# EAGLE design 6566_adapter_2 (EAGLE 6.4)
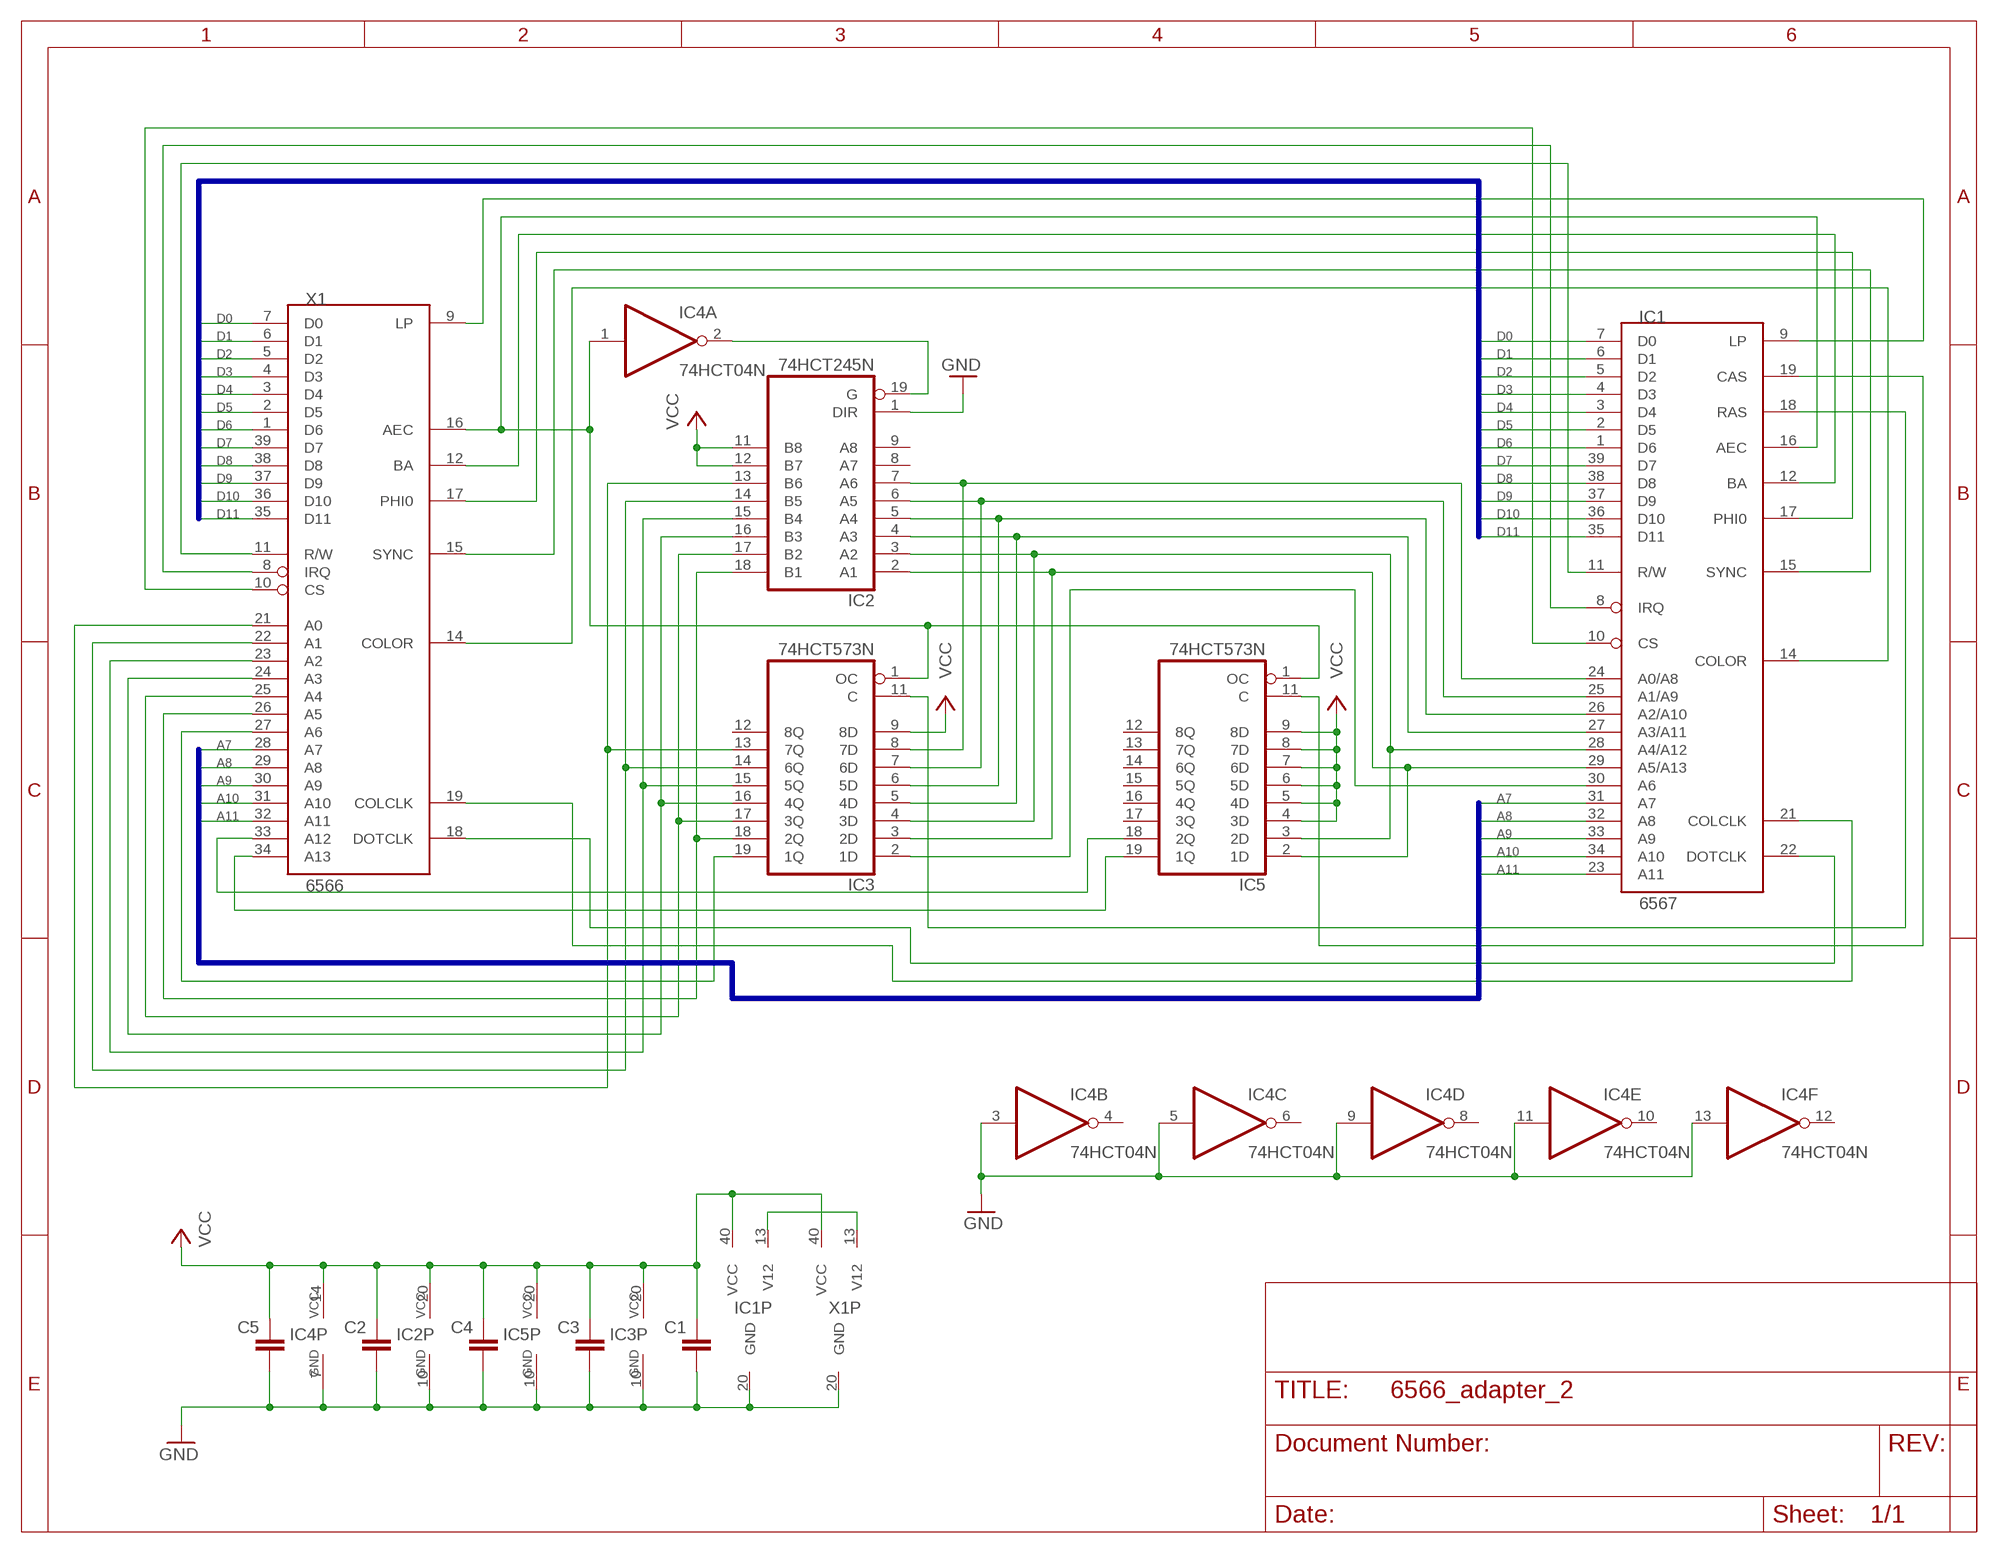
[diagram p0: schematic, sheet 1]

## Parts
C1  C-EU025-025X050  [C025-025X050]
C2  C-EU025-025X050  [C025-025X050]
C3  C-EU025-025X050  [C025-025X050]
C4  C-EU025-025X050  [C025-025X050]
C5  C-EU025-025X050  [C025-025X050]
IC1  6567  6569  [DIP40]
IC2  74HCT245N  [DIL20]
IC3  74HCT573N  [DIL20]
IC4  74HCT04N  [DIL14]
IC5  74HCT573N  [DIL20]
X1  6566  [DIL40]

## Nets
!AEC: IC2.19(G) IC4.2(A:O)
!CS: IC1.10(CS) X1.10(CS)
!IRQ: IC1.8(IRQ) X1.8(IRQ)
A0: IC2.13(B6) IC3.13(7Q) X1.21(A0)
A0_6567: IC1.24(A0/A8) IC2.7(A6) IC3.8(7D)
A1: IC2.14(B5) IC3.14(6Q) X1.22(A1)
A1_6567: IC1.25(A1/A9) IC2.6(A5) IC3.7(6D)
A2: IC2.15(B4) IC3.15(5Q) X1.23(A2)
A2_6567: IC1.26(A2/A10) IC2.5(A4) IC3.6(5D)
A3: IC2.16(B3) IC3.16(4Q) X1.24(A3)
A3_6567: IC1.27(A3/A11) IC2.4(A3) IC3.5(4D)
A4: IC2.17(B2) IC3.17(3Q) X1.25(A4)
A4_6567: IC1.28(A4/A12) IC2.3(A2) IC3.4(3D) IC5.3(2D)
A5: IC2.18(B1) IC3.18(2Q) X1.26(A5)
A5_6567: IC1.29(A5/A13) IC2.2(A1) IC3.3(2D) IC5.2(1D)
A6: IC3.19(1Q) X1.27(A6)
A6_6567: IC1.30(A6) IC3.2(1D)
A7: IC1.31(A7) X1.28(A7)
A8: IC1.32(A8) X1.29(A8)
A9: IC1.33(A9) X1.30(A9)
A10: IC1.34(A10) X1.31(A10)
A11: IC1.23(A11) X1.32(A11)
A12: IC5.18(2Q) X1.33(A12)
A13: IC5.19(1Q) X1.34(A13)
AEC: IC1.16(AEC) IC3.1(OC) IC4.1(A:I) IC5.1(OC) X1.16(AEC)
BA: IC1.12(BA) X1.12(BA)
CAS: IC1.19(CAS) IC5.11(C)
COLCLK: IC1.21(COLCLK) X1.19(COLCLK)
COLOR: IC1.14(COLOR) X1.14(COLOR)
D0: IC1.7(D0) X1.7(D0)
D1: IC1.6(D1) X1.6(D1)
D2: IC1.5(D2) X1.5(D2)
D3: IC1.4(D3) X1.4(D3)
D4: IC1.3(D4) X1.3(D4)
D5: IC1.2(D5) X1.2(D5)
D6: IC1.1(D6) X1.1(D6)
D7: IC1.39(D7) X1.39(D7)
D8: IC1.38(D8) X1.38(D8)
D9: IC1.37(D9) X1.37(D9)
D10: IC1.36(D10) X1.36(D10)
D11: IC1.35(D11) X1.35(D11)
DOTCLK: IC1.22(DOTCLK) X1.18(DOTCLK)
GND: C1.2 C2.2 C3.2 C4.2 C5.2 IC1.20(GND) IC2.1(DIR) IC2.10(GND) IC3.10(GND) IC4.3(B:I) IC4.5(C:I) IC4.7(P:GND) IC4.9(D:I) IC4.11(E:I) IC4.13(F:I) IC5.10(GND) X1.20(GND)
LP: IC1.9(LP) X1.9(LP)
PHI0: IC1.17(PHI0) X1.17(PHI0)
R/W: IC1.11(R/W) X1.11(R/W)
RAS: IC1.18(RAS) IC3.11(C)
SYNC: IC1.15(SYNC) X1.15(SYNC)
V12: IC1.13(V12) X1.13(V12)
VCC: C1.1 C2.1 C3.1 C4.1 C5.1 IC1.40(VCC) IC2.11(B8) IC2.12(B7) IC2.20(VCC) IC3.9(8D) IC3.20(VCC) IC4.14(P:VCC) IC5.4(3D) IC5.5(4D) IC5.6(5D) IC5.7(6D) IC5.8(7D) IC5.9(8D) IC5.20(VCC) X1.40(VCC)
Unconnected: IC2.8(A7) IC2.9(A8) IC3.12(8Q) IC4.4(B:O) IC4.6(C:O) IC4.8(D:O) IC4.10(E:O) IC4.12(F:O) IC5.12(8Q) IC5.13(7Q) IC5.14(6Q) IC5.15(5Q) IC5.16(4Q) IC5.17(3Q)

## Buses
D[0..11]
A[7..11]

## Library data of the parts
C1-C5 = rcl:C-EU: CAPACITOR, European symbol
IC1 = 0RB_65xx:6569
IC2 = 74xx-eu:74*245: Octal BUS TRANSCEIVER, 3-state
IC3 IC5 = 74xx-eu:74*573: 8-bit D latch BUS DRIVER
IC4 = 74xx-eu:74*04: Hex INVERTER
X1 = 0RB_65xx:6566

## Board
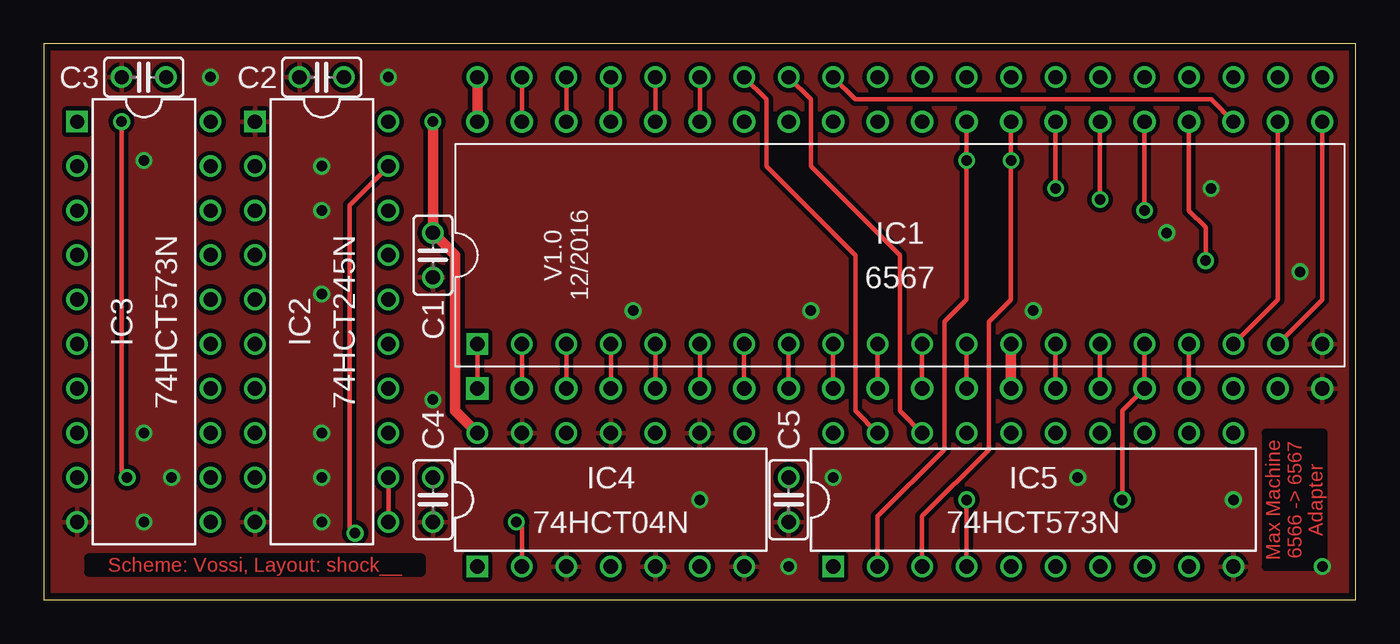
[diagram p1: board, top side]
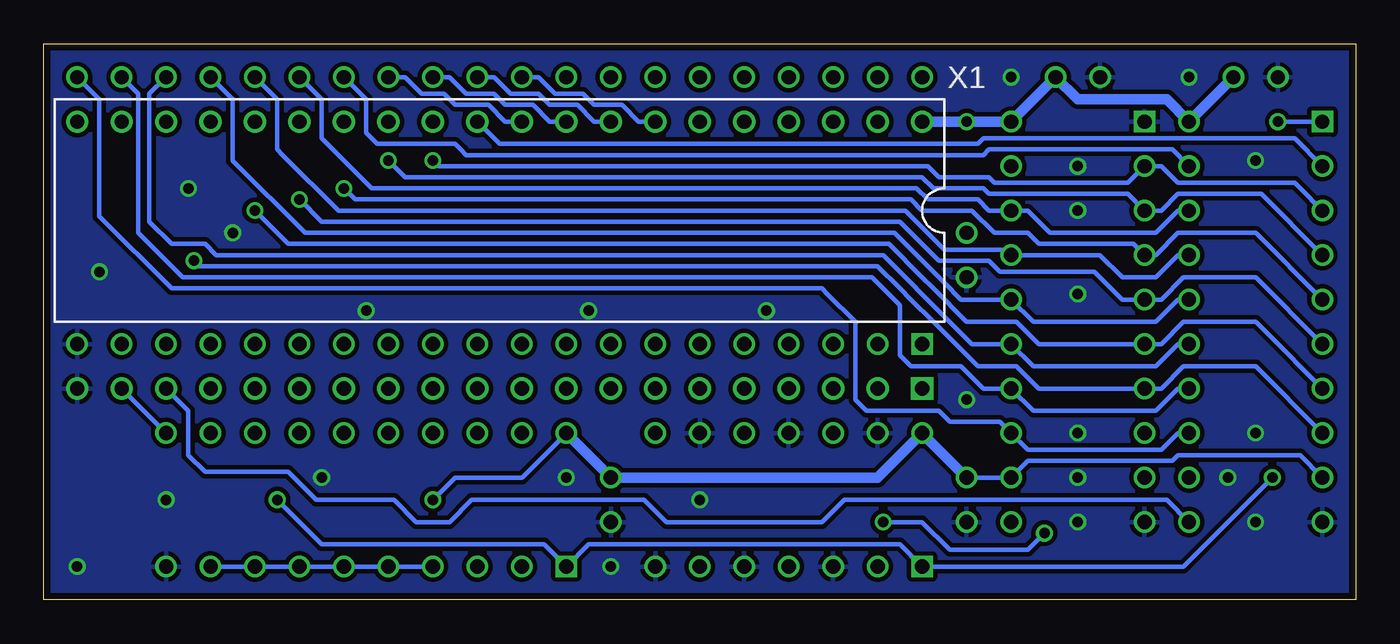
[diagram p2: board, bottom side, seen from below]

Size 74.93 x 31.75 mm. Coordinates in mm from the lower left corner, seen from the top.
Outline: 74.93,0 74.93,31.75 0,31.75 0,0 74.93,0
Copper layers (1*16): Top 0.0356mm / dielectric 1.5011mm / Bottom 0.0356mm
Design rules "oshpark-2layer *": minimum track width 6mil, minimum drill 13mil, track to track 6mil, track to pad 6mil, pad to pad 6mil, via to via 6mil, smd to smd 6mil, copper to edge 15mil, drill to drill 6mil, minimum pad ring 7mil, minimum via ring 7mil, stop-mask expansion 2.5mil, vias tented up to drill 0.65mm, thermal gap 10mil

### Footprints (pad centres in the part's own frame; a part is rotated, then mirrored left to right if it is on the bottom)
C025-025X050 = drill 0.813: 1 -1.27,0; 2 1.27,0
DIP40 = drill 0.813 pad 1.27 square: 1 -24.13,-7.62 | drill 0.813 pad 1.27: 2 -21.59,-7.62; 3 -19.05,-7.62; 4 -16.51,-7.62; 5 -13.97,-7.62; 6 -11.43,-7.62; 7 -8.89,-7.62; 8 -6.35,-7.62; 9 -3.81,-7.62; 10 -1.27,-7.62; 11 1.27,-7.62; 12 3.81,-7.62; 13 6.35,-7.62; 14 8.89,-7.62; 15 11.43,-7.62; 16 13.97,-7.62; 17 16.51,-7.62; 18 19.05,-7.62; 19 21.59,-7.62; 20 24.13,-7.62; 21 24.13,7.62; 22 21.59,7.62; 23 19.05,7.62; 24 16.51,7.62; 25 13.97,7.62; 26 11.43,7.62; 27 8.89,7.62; 28 6.35,7.62; 29 3.81,7.62; 30 1.27,7.62; 31 -1.27,7.62; 32 -3.81,7.62; 33 -6.35,7.62; 34 -8.89,7.62; 35 -11.43,7.62; 36 -13.97,7.62; 37 -16.51,7.62; 38 -19.05,7.62; 39 -21.59,7.62; 40 -24.13,7.62
DIL20 = drill 0.813 square: 1 -11.43,-3.81 | drill 0.813: 2 -8.89,-3.81; 3 -6.35,-3.81; 4 -3.81,-3.81; 5 -1.27,-3.81; 6 1.27,-3.81; 7 3.81,-3.81; 8 6.35,-3.81; 9 8.89,-3.81; 10 11.43,-3.81; 11 11.43,3.81; 12 8.89,3.81; 13 6.35,3.81; 14 3.81,3.81; 15 1.27,3.81; 16 -1.27,3.81; 17 -3.81,3.81; 18 -6.35,3.81; 19 -8.89,3.81; 20 -11.43,3.81
DIL14 = drill 0.813 square: 1 -7.62,-3.81 | drill 0.813: 2 -5.08,-3.81; 3 -2.54,-3.81; 4 0,-3.81; 5 2.54,-3.81; 6 5.08,-3.81; 7 7.62,-3.81; 8 7.62,3.81; 9 5.08,3.81; 10 2.54,3.81; 11 0,3.81; 12 -2.54,3.81; 13 -5.08,3.81; 14 -7.62,3.81
DIL40 = drill 0.813 square: 1 -24.13,-7.62 | drill 0.813: 2 -21.59,-7.62; 3 -19.05,-7.62; 4 -16.51,-7.62; 5 -13.97,-7.62; 6 -11.43,-7.62; 7 -8.89,-7.62; 8 -6.35,-7.62; 9 -3.81,-7.62; 10 -1.27,-7.62; 11 1.27,-7.62; 12 3.81,-7.62; 13 6.35,-7.62; 14 8.89,-7.62; 15 11.43,-7.62; 16 13.97,-7.62; 17 16.51,-7.62; 18 19.05,-7.62; 19 21.59,-7.62; 20 24.13,-7.62; 21 24.13,7.62; 22 21.59,7.62; 23 19.05,7.62; 24 16.51,7.62; 25 13.97,7.62; 26 11.43,7.62; 27 8.89,7.62; 28 6.35,7.62; 29 3.81,7.62; 30 1.27,7.62; 31 -1.27,7.62; 32 -3.81,7.62; 33 -6.35,7.62; 34 -8.89,7.62; 35 -11.43,7.62; 36 -13.97,7.62; 37 -16.51,7.62; 38 -19.05,7.62; 39 -21.59,7.62; 40 -24.13,7.62

### Placement (x,y rotation side)
C1  22.23,19.68 270 top
C2  15.88,29.84 180 top
C3  5.71,29.84 180 top
C4  22.23,5.71 270 top
C5  42.55,5.71 270 top
IC1  48.9,19.68 0 top
IC2  15.88,15.88 270 top
IC3  5.71,15.88 270 top
IC4  32.38,5.71 0 top
IC5  56.52,5.71 0 top
X1  48.9,22.23 0 top

### Tracks (layer width: path | path; a pad name or v marks a point on that pad's centre or on a via)
!AEC  (via drill 0.6)
  Top 0.254: IC2.19 17.46,22.54 17.46,4.13 v17.78,3.81 | v26.99,4.45 27.3,4.13 IC4.2
  Bottom 0.254: v17.78,3.81 18.73,2.86 23.18,2.86 24.77,4.45 v26.99,4.45
!CS
  Top 0.254: X1.10 IC1.10
!IRQ
  Top 0.254: X1.8 IC1.8
A0
  Bottom 0.254: X1.21 71.75,28.57 71.75,21.91 67.63,17.78 65.41,17.78 64.77,17.78 48.9,17.78 48.26,17.78 30.48,17.78 30.16,17.46 28.57,15.88 28.57,11.43 27.94,10.79 23.81,10.79 23.18,10.16 20.32,10.16 IC2.13 18.73,8.57 11.11,8.57 10.16,9.53 IC3.13
A0_6567  (via drill 0.6)
  Top 0.254: v66.36,19.37 66.36,21.27 65.41,22.23 IC1.24
  Bottom 0.254: IC3.8 5.71,13.34 9.84,13.34 11.11,12.06 IC2.7 18.1,12.06 19.37,13.34 20,13.34 21.59,13.34 24.13,15.88 25.4,17.14 26.04,17.78 27.3,19.05 48.9,19.05 49.53,19.05 66.04,19.05 v66.36,19.37
A1
  Bottom 0.254: X1.22 69.53,28.89 69.53,20.95 66.99,18.41 66.04,18.41 65.09,18.41 49.21,18.41 48.58,18.41 27.62,18.41 26.04,16.83 26.04,13.97 25.4,13.34 22.54,13.34 21.27,12.06 IC2.14 18.41,10.79 11.43,10.79 10.16,12.06 IC3.14
A1_6567  (via drill 0.6)
  Top 0.254: v62.87,22.23 IC1.25
  Bottom 0.254: IC3.7 5.08,15.24 5.71,15.88 9.84,15.88 11.11,14.61 IC2.6 18.1,14.61 19.37,15.88 20,15.88 22.23,15.88 24.13,17.78 24.77,18.41 26.67,20.32 49.53,20.32 50.16,20.32 60.96,20.32 v62.87,22.23
A2
  Bottom 0.254: IC3.15 10.16,14.61 11.43,13.34 18.41,13.34 IC2.15 21.91,14.61 24.77,17.46 25.4,18.1 26.99,19.68 27.94,19.68 49.53,19.68 49.85,19.68 62.23,19.68 65.09,19.68 65.72,20.32 67.63,20.32 68.9,21.59 68.9,28.89 X1.23
A2_6567  (via drill 0.6)
  Top 0.254: v60.33,22.86 IC1.26
  Bottom 0.254: IC3.6 5.71,18.41 9.84,18.41 11.11,17.14 IC2.5 | 11.75,17.14 IC2.5 | v60.33,22.86 59.05,21.59 50.8,21.59 50.16,21.59 26.04,21.59 23.81,19.37 20.95,19.37 20.32,18.73 14.92,18.73 13.34,17.14 IC2.5
A3
  Bottom 0.254: IC3.16 10.16,17.14 11.43,15.88 18.41,15.88 IC2.16 22.54,17.14 23.5,18.1 24.13,18.73 26.35,20.95 49.85,20.95 50.48,20.95 60.01,20.95 64.14,25.08 64.14,26.04 64.14,28.57 X1.24
A3_6567  (via drill 0.6)
  Top 0.254: v57.78,23.5 IC1.27
  Bottom 0.254: IC3.5 5.71,20.95 10.16,20.95 11.43,19.68 IC2.4 12.7,20.32 18.1,20.32 18.73,20.95 20.64,20.95 21.91,22.23 24.77,22.23 25.4,22.86 50.8,22.86 51.44,22.86 57.15,22.86 v57.78,23.5
A4
  Bottom 0.254: IC3.17 10.16,19.68 11.43,18.41 13.34,18.41 14.61,19.68 IC2.17 20,20 23.5,20 25.72,22.23 50.48,22.23 51.12,22.23 58.1,22.23 61.28,25.4 61.59,25.72 61.59,28.57 X1.25
A4_6567  (via drill 0.6)
  Top 0.254: IC1.28 v55.24,25.08 55.24,17.14 53.98,15.88 53.98,8.57 50.16,4.76 IC5.3
  Bottom 0.254: IC3.4 5.4,23.18 10.16,23.18 11.11,22.23 IC2.3 13.02,23.18 20.95,23.18 21.27,23.5 24.13,23.5 24.77,24.13 51.44,24.13 52.07,24.13 54.29,24.13 v55.24,25.08
A5
  Bottom 0.254: X1.26 59.05,28.57 59.05,26.35 58.42,25.72 56.2,23.5 51.75,23.5 51.12,23.5 25.08,23.5 24.45,22.86 21.59,22.86 20.95,22.23 IC2.18 18.73,22.23 17.46,20.95 11.43,20.95 10.16,22.23 IC3.18
A5_6567  (via drill 0.6)
  Top 0.254: IC1.29 v52.7,25.08 52.7,17.14 51.44,15.88 51.44,8.57 47.62,4.76 IC5.2
  Bottom 0.254: IC3.3 3.17,23.5 3.49,23.81 10.16,23.81 11.11,24.77 IC2.2 13.02,23.81 20.64,23.81 20.95,24.13 23.81,24.13 24.45,24.77 52.39,24.77 v52.7,25.08
A6
  Bottom 0.254: IC3.19 10.48,25.72 20.95,25.72 21.27,25.4 50.8,25.4 51.12,25.72 51.44,26.04 55.88,26.04 56.52,26.67 56.52,28.57 X1.27
A6_6567
  Bottom 0.254: IC3.2 3.49,26.35 21.27,26.35 21.59,26.04 48.9,26.04 IC1.30
A7
  Bottom 0.254: IC1.31 48.58,27.3 49.53,28.26 51.44,28.26 52.07,28.89 53.34,28.89 54.29,29.84 X1.28
A8
  Bottom 0.254: IC1.32 46.04,27.3 46.99,28.26 48.58,28.26 49.21,28.89 50.8,28.89 51.75,29.84 X1.29
A9
  Bottom 0.254: IC1.33 43.5,27.3 44.45,28.26 46.04,28.26 46.67,28.89 48.26,28.89 49.21,29.84 X1.30
A10
  Bottom 0.254: IC1.34 40.96,27.3 41.91,28.26 43.5,28.26 44.13,28.89 45.72,28.89 46.67,29.84 X1.31
A11
  Top 0.254: X1.32 46.35,28.57 66.67,28.57 IC1.23
A12
  Top 0.254: X1.33 43.81,28.57 43.81,24.77 48.9,19.68 48.9,10.79 IC5.18
A13
  Top 0.254: X1.34 41.27,28.57 41.27,24.77 46.35,19.68 46.35,10.79 IC5.19
AEC  (via drill 0.6)
  Top 0.254: v4.45,27.3 4.45,7.3 v4.76,6.99 | X1.16 IC1.16 61.59,10.79 v61.59,5.71
  Bottom 0.254: IC3.1 v4.45,27.3 | v4.76,6.99 9.84,1.91 IC4.1 26.04,3.17 43.81,3.17 IC5.1 46.35,3.17 59.05,3.17 v61.59,5.71
BA
  Top 0.254: X1.12 IC1.12
CAS
  Bottom 0.254: IC1.19 IC5.11
COLCLK
  Top 0.254: IC1.21 73.03,17.14 X1.19
COLOR
  Top 0.254: X1.14 IC1.14
D0
  Top 0.254: X1.7 IC1.7
D1
  Top 0.254: X1.6 IC1.6
D2
  Top 0.254: X1.5 IC1.5
D3
  Top 0.254: X1.4 IC1.4
D4
  Top 0.254: X1.3 IC1.3
D5
  Top 0.254: X1.2 IC1.2
D6
  Top 0.254: X1.1 IC1.1
D7
  Top 0.254: X1.39 IC1.39
D8
  Top 0.254: X1.38 IC1.38
D9
  Top 0.254: X1.37 IC1.37
D10
  Top 0.254: X1.36 IC1.36
D11
  Top 0.254: X1.35 IC1.35
DOTCLK
  Top 0.254: IC1.22 70.48,17.14 X1.18
GND  (via drill 0.6)
  other vias: 42.55,1.91 22.23,11.43 15.88,4.45 5.71,4.45 7.3,6.99 15.88,6.99 37.47,5.71 67.94,5.71 59.05,6.99 66.67,23.5 71.75,18.73 56.52,16.51 43.81,16.51 33.66,16.51 5.71,25.08 15.88,22.23 15.88,9.53 15.88,24.77 5.71,9.53 19.68,29.84 64.14,20.95 73.03,1.91 9.53,29.84 45.09,6.99 15.88,17.46
  pour Top (isolate 0.254): -0.64,32.38 -0.64,-0.64 75.56,-0.64 75.56,32.38
  pour Bottom (isolate 0.254): -0.64,32.38 -0.64,-0.64 75.56,-0.64 75.56,32.38
LP
  Top 0.254: X1.9 IC1.9
PHI0
  Top 0.254: X1.17 IC1.17
R/W
  Top 0.254: X1.11 IC1.11
RAS
  Bottom 0.254: IC1.18 66.67,10.79 66.67,8.26 65.72,7.3 60.96,7.3 59.37,5.71 54.93,5.71 53.66,4.45 51.75,4.45 50.48,5.71 40.64,5.71 39.37,4.45 30.48,4.45 29.21,5.71 22.86,5.71 10.79,5.71 IC3.11
SYNC
  Top 0.254: X1.15 IC1.15
V12
  Top 0.61: X1.13 IC1.13
VCC  (via drill 0.6)
  Top 0.254: IC2.11 IC2.12 | IC5.4 v52.7,5.71
  Top 0.61: X1.40 IC1.40 | v22.23,27.3 C1.1 22.54,20.64 23.5,19.68 23.5,10.79 IC4.14
  Bottom 0.254: IC5.9 IC5.8 IC5.7 IC5.6 IC5.5 IC5.4 | IC3.9 3.17,8.26 10.16,8.26 10.48,7.94 18.73,7.94 IC2.12 C4.1 | v52.7,5.71 51.75,6.67 51.44,6.99 47.62,6.99 IC5.20
  Bottom 0.61: IC1.40 v22.23,27.3 IC2.20 C2.1 15.88,28.57 10.79,28.57 IC3.20 C3.1 | C4.1 IC4.14 27.3,6.99 C5.1 IC5.20

### Text on the board
Top: Max Machine / 6566 -> 6567 / Adapter | Scheme: Vossi, Layout: shock__
tPlace: V1.0 / 12/2016
tStop: Max Machine / 6566 -> 6567 / Adapter | Scheme: Vossi, Layout: shock__